# EAGLE design usbc-test (EAGLE 9.6.2)
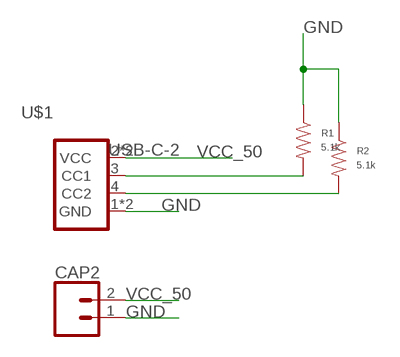
[diagram p0: schematic, sheet 1]

## Parts
CAP2  CONN_02  [1X02]
R1  5.1k  RESISTOR_0603  [R0603]
R2  5.1k  RESISTOR_0603  [R0603]
U$1  USB-C-2  [USB-C-16]

## Nets
GND: CAP2.1 R1.P$1 R2.P$1 U$1.1(GND) U$1.6(GND)
N$2: R1.P$2 U$1.3(CC1)
N$3: R2.P$2 U$1.4(CC2)
VCC_50: CAP2.2 U$1.2(VCC) U$1.5(VCC)

## Library data of the parts
CAP2 = SparkFun-Connectors:CONN_02: Multi connection point. Often used as Generic Header-pin footprint for 0.1 inch spaced/style header connections On any of the 0.1 inch spaced packages, you can populate with these: Break Away Headers - Straight <https://www.sparkfun.com/products/116> (PRT-00116) Break Away Male Headers - Right Angle <https://www.sparkfun.com/products/553> (PRT-00553) Female Headers <https://www.sparkfun.com/products/115> (PRT-00115) Break Away Headers - Machine Pin <https://www.sparkfun.com/products/117> (PRT-00117) Break Away Female Headers - Swiss Machine Pin <https://www.sparkfun.com/products/743> (PRT-00743) For SCREWTERMINALS and SPRING TERMINALS visit here: Screw Terimnals on SparkFun.com <https://www.sparkfun.com/search/results?term=Screw+Terminals> (5mm/3.5mm/2.54mm spacing) This device is also useful as a general connection point to wire up your design to another part of your project. Our various solder wires solder well into these plated through hole pads. Hook-Up Wire - Assortment (Stranded, 22 AWG) <https://www.sparkfun.com/products/11375> (PRT-11375) Hook-Up Wire - Assortment (Solid Core, 22 AWG) <https://www.sparkfun.com/products/11367> (PRT-11367) View the entire wire category on our website here <https://www.sparkfun.com/categories/141> Special notes: Molex polarized connector foot print use with: PRT-08233 with associated crimp pins and housings. 2.54_SCREWTERM for use with PRT-10571. 3.5mm Screw Terminal footprints for PRT-08084 5mm Screw Terminal footprints for use with PRT-08432
R1 R2 = 00jim:RESISTOR: Library: MF_Passives Description: Device for Resistors. Manufacture part number (MPN), Voltage, Tolerance, and Wattage Rating can be added via Attributes. Check https://factory.macrofab.com/parts for the house parts list.; POPULATE: 1
U$1 = 01jim:USB-C-2

## Board
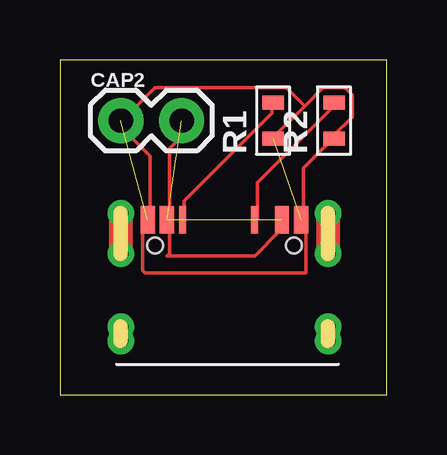
[diagram p1: board, top side]
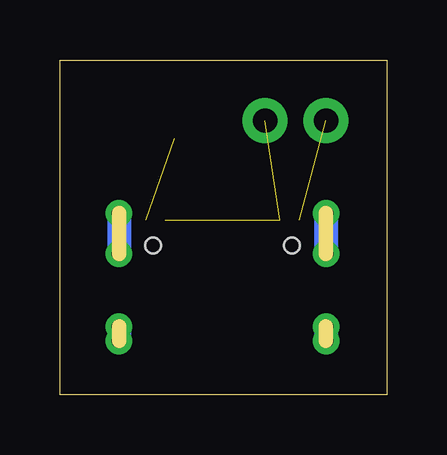
[diagram p2: board, bottom side, seen from below]

Size 13.64 x 13.96 mm. Coordinates in mm from the lower left corner, seen from the top.
Outline: 0,0 13.64,0 13.64,13.96 0,13.96 0,0
Copper layers (1*16): Top 0.035mm / dielectric 1.5mm / Bottom 0.035mm
Design rules "default *": minimum track width 6mil, minimum drill 0.35mm, track to track 4mil, track to pad 4mil, pad to pad 4mil, via to via 4mil, smd to smd 4mil, copper to edge 40mil, drill to drill 6mil, minimum pad ring 10mil, minimum via ring 8mil, stop-mask expansion 4mil, vias tented up to drill 0mil, thermal gap 10mil

### Footprints (pad centres in the part's own frame; a part is rotated, then mirrored left to right if it is on the bottom)
1X02 = drill 1.016 pad 1.88: 1 0,0; 2 2.54,0
R0603 = smd 0.6 x 0.9: P$1 -0.75,0; P$2 0.75,0
USB-C-16 = smd 0.6 x 1.15: 1 1.12,4.75; 2 1.92,4.75; 5 6.72,4.75; 6 7.52,4.75 | smd 0.3 x 1.15: 3 2.57,4.75; 4 5.57,4.75 | drill 0.6 pad 1: P$1 8.64,5.03; P$2 0,0.3; P$4 8.64,3.33; P$5 8.64,0.3; P$6 8.64,-0.3; P$7 0,-0.3; P$8 0,5.03; P$9 0,3.33 | hole 0.65: 1.43,3.68; 7.21,3.68

### Placement (x,y rotation side)
CAP2  2.54,11.43 0 top
R1  8.89,11.43 90 top
R2  11.43,11.43 90 top
U$1  2.54,2.54 0 top

### Tracks (layer width: path | path; a pad name or v marks a point on that pad's centre or on a via)
GND  (2 unrouted)
  Top 0.152: 10.21,12.04 10.97,12.8 11.89,12.8 12.19,12.5 12.19,11.58 11.43,10.82 R2.P$1 | 10.21,12.04 8.99,10.82 R1.P$1 | 10.21,12.04 9.45,12.8 3.96,12.8 2.59,11.43 CAP2.1
N$1
  Top 0.152: 3.76,7.82 3.76,9.96 2.95,10.77
N$2
  Top 0.152: R1.P$2 8.84,12.04 8.84,11.73 5.18,8.08 5.18,7.32 U$1.3
N$3
  Top 0.152: R2.P$2 11.43,12.04 8.23,8.84 8.23,7.32 U$1.4
N$4
  Top 0.152: 4.57,7.62 4.57,10.26 5.08,10.77
N$5
  Top 0.152: 10.16,7.52 10.16,9.45 11.28,10.57
N$6
  Top 0.152: 3.45,6.81 3.45,5.18 3.56,5.08 10.26,5.08 10.26,6.81
N$7
  Top 0.152: 4.57,6.81 4.57,5.89 4.47,5.79 8.13,5.79 9.14,6.81
VCC_50  (2 unrouted)